# Altium schematic sheet power.SchDoc
size A
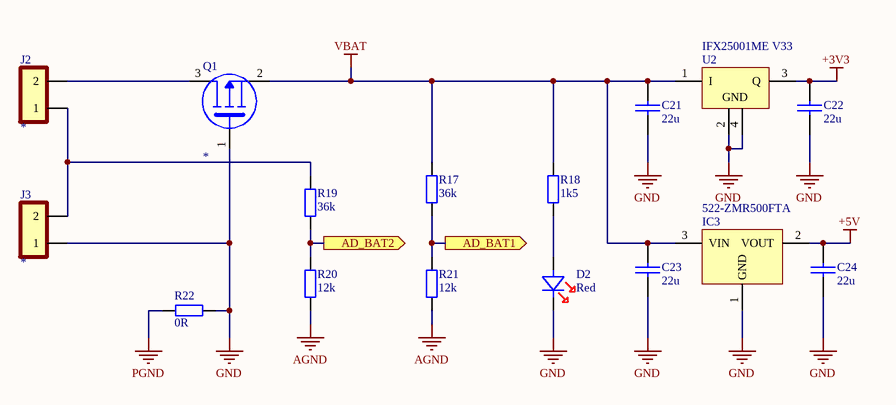
[diagram p0: power.SchDoc]

## Parts
C21  22u  [C0603_PASTE]
C22  22u  [C0603_PASTE]
C23  22u  [C0603_PASTE]
C24  22u  [C0603_PASTE]
D2  Red  [LED0402_RED]
IC3  Supplier Part Number 1: 522-ZMR500FTA  [SOT-23]  (hidden comment: ZMR500FTA)
J2  *  [CON-2x1-JMP]
J3  *  [CON-2x1-JMP]
Q1  *  [SOT-23]
R17  36k  [R0603_PASTE]
R18  1k5  [R0603_PASTE]
R19  36k  [R0603_PASTE]
R20  12k  [R0603_PASTE]
R21  12k  [R0603_PASTE]
R22  0R  [R0201-paste]
U2  IFX25001ME V33  [INF-PG-SOT223_SC-73_L]

## Ports
AD_BAT1 (out), AD_BAT2 (out)

## Nets
+3V3: C22.1 U2.3(Q)
+5V: C24.1 IC3.2(VOUT)
AGND: R20.2 R21.2
GND: C21.2 C22.2 C23.2 C24.2 D2.2(CATHODE) IC3.1(GND) J3.1 Q1.1(GATE) R22.2 U2.2(GND) U2.4(GND)
PGND: R22.1
VBAT: C21.1 C23.1 IC3.3(VIN) Q1.2(DRAIN) R17.1 R18.1 U2.1(I)
AD_BAT1: R17.2 R21.1 ; port AD_BAT1
AD_BAT2: R19.2 R20.1 ; port AD_BAT2
NetD2_1: D2.1(ANODE) R18.2
NetJ2_1: J2.1 J3.2 R19.1
NetJ2_2: J2.2 Q1.3(SOURCE)

## Library data of the parts
C21-C24 = C-0603: Multilayer Ceramic Capacitors MLCC - SMD 0603; Value: 22u; Manufacturer: -; Manufacturer PN: -; Supplier: digikey.ca
D2 = LED_0402_Red: Standard LEDs - SMD SMD 0402 Red; Manufacturer PN: XZMDK68W-2; Manufacturer: SunLED; Value: Red; Supplier: digikey.com
IC3 = ZMR500FTA: IC REG LINEAR 5V 50MA SOT23-3; Manufacturer 1: Diodes Zetex; Max Input Voltage: 25V; Min Input Voltage: 7V; Number of Outputs: 1; Max Power Dissipation: 500mW; Polarity: Positive; Output Type: Fixed; Dropout Voltage: 1.2V; Quiescent Current: 30uA; Power Supply Rejection Ratio (PSRR): 55dB; Supplier 1: Mouser; Manufacturer Part Number 1: ZMR500FTA; Stock 1: 9051; Pricing 1: 1=0.91000, 10=0.76000, 100=0.49000, 1000=0.39200, 3000=0.39200, 9000=0.39200 (USD); RoHS: Yes; Mount: Surface Mount; Case/Package: SOT-23; Number of Pins: 3; Weight: 0.000282oz; Min Operating Temperature: -55°C; Max Operating Temperature: 125°C; Output Voltage: 5V; Max Output Current: 50mA; Nominal Output Voltage: 5V; Packaging: Tape and Reel; Output Current: 50mA; Package Quantity: 3000; Power Rating: 500mW; Number of Regulators: 1; Power Dissipation: 500mW; Min Output Voltage: 5V; Length: 3.04mm; Height: 1.02mm; Width: 1.4mm; Radiation Hardening: No; REACH SVHC: No SVHC; Lead Free: Lead Free; ComponentLink1URL: https://datasheet.ciiva.com/15111/getdatasheetpartid-74239-15111397.pdf?src-supplier=Verical; ComponentLink1Description: https://datasheet.ciiva.com/15111/getdatasheetpartid-74239-15111397.pdf?src-supplier=Verical; ComponentLink2URL: https://datasheet.ciiva.com/5786/60079-5786598.pdf?src-supplier=Farnell; ComponentLink2Description: https://datasheet.ciiva.com/5786/60079-5786598.pdf?src-supplier=Farnell; ComponentLink3URL: https://datasheet.ciiva.com/26907/zmr500fta-26907457.pdf?src-supplier=IIIC; ComponentLink3Description: https://datasheet.ciiva.com/26907/zmr500fta-26907457.pdf?src-supplier=IIIC; ComponentLink4URL: https://datasheet.ciiva.com/8078/60079-8078251.pdf?src-supplier=Element14; ComponentLink4Description: https://datasheet.ciiva.com/8078/60079-8078251.pdf?src-supplier=Element14; ComponentLink5URL: https://datasheet.ciiva.com/8078/60079-8078252.pdf?src-supplier=Element14; ComponentLink5Description: https://datasheet.ciiva.com/8078/60079-8078252.pdf?src-supplier=Element14; ComponentLink6URL: https://datasheet.ciiva.com/16217/zmrseries-16217950.pdf?src-supplier=Future+Electronics; ComponentLink6Description: https://datasheet.ciiva.com/16217/zmrseries-16217950.pdf?src-supplier=Future+Electronics; ComponentLink7URL: https://datasheet.ciiva.com/8240/zmrseries-8240239.pdf?src-supplier=Avnet; ComponentLink7Description: https://datasheet.ciiva.com/8240/zmrseries-8240239.pdf?src-supplier=Avnet
J2 J3 = CON-2x1-JMP: 2 Positions Header 2.54mm; Manufacturer: Molex, LLC; Manufacturer PN: 0901200762; Value: *; Supplier: digikey.ca
Q1 = MOSFET-P: MOSFET P-CH  SOT23; Manufacturer PN: DMG2305UX-13; Manufacturer: Diodes Incorporated; Value: *; Supplier: digikey.ca
R17-R21 = R-0603: RES SMD 0603; Manufacturer: -; Manufacturer PN: -; Supplier: digikey.ca
  R17 R19: Value: 36k
  R18: Value: 1k5
  R20 R21: Value: 12k
R22 = R-0201: RES SMD 0201; Value: 0R; Manufacturer: -; Manufacturer PN: -; Supplier: digikey.ca
U2 = CMP-1136-00017-1: Low Dropout Voltage Regulator, 4.7 to 40 V Operating, 400 mA, -40 to 125 degC, PG-SOT223 (SC-73), Reel, Green; Manufacturer: Infineon; Typical Quiescent Current: 100 uA; Regulator Type: Linear->single output; Accuracy: 4.0Â %; Green: TRUE; Automotive Qualified: FALSE; Max Peak Reflow Temp: 260Â degreesC; Output Voltage: 3.3 V; Max. Output Current: 400 mA; Max Number Reflow: 3; Dropout Voltage: 700 mV; ComponentLink3URL: http://www.infineon.com/dgdl/SOT223-Package_Overview.pdf?folderId=db3a30431936bc4b0119530470b03c3d&fileId=db3a30431936bc4b0119531d40b93c5c; Packing: Reel; ComponentLink2Description: Datasheet; DatasheetVersion: Rev. 1.02; PackageDescription: 4-Pin Small Outline Transistor Package, 6.5 x 3.5 mm Body, 2.3 mm Pitch; MSL: 1; PackageVersion: Apr-08; Reset: FALSE; ComponentLink1URL: http://www.infineon.com/; PartNumber: IFX25001ME V33; ComponentLink1Description: Manufacturer URL; ComponentLink3Description: Package Specification; ComponentLink2URL: http://www.infineon.com/dgdl/IFX25001_DS_102.pdf?folderId=db3a30431ff988150120802bce1d257a&fileId=db3a304320d39d590120f620f1e269da; Status Output: FALSE; Mounting Technology: Surface Mount; PackageReference: PG-SOT223 (SC-73)